# Altium schematic sheet 03.SchDoc
size 386 x 246 mm
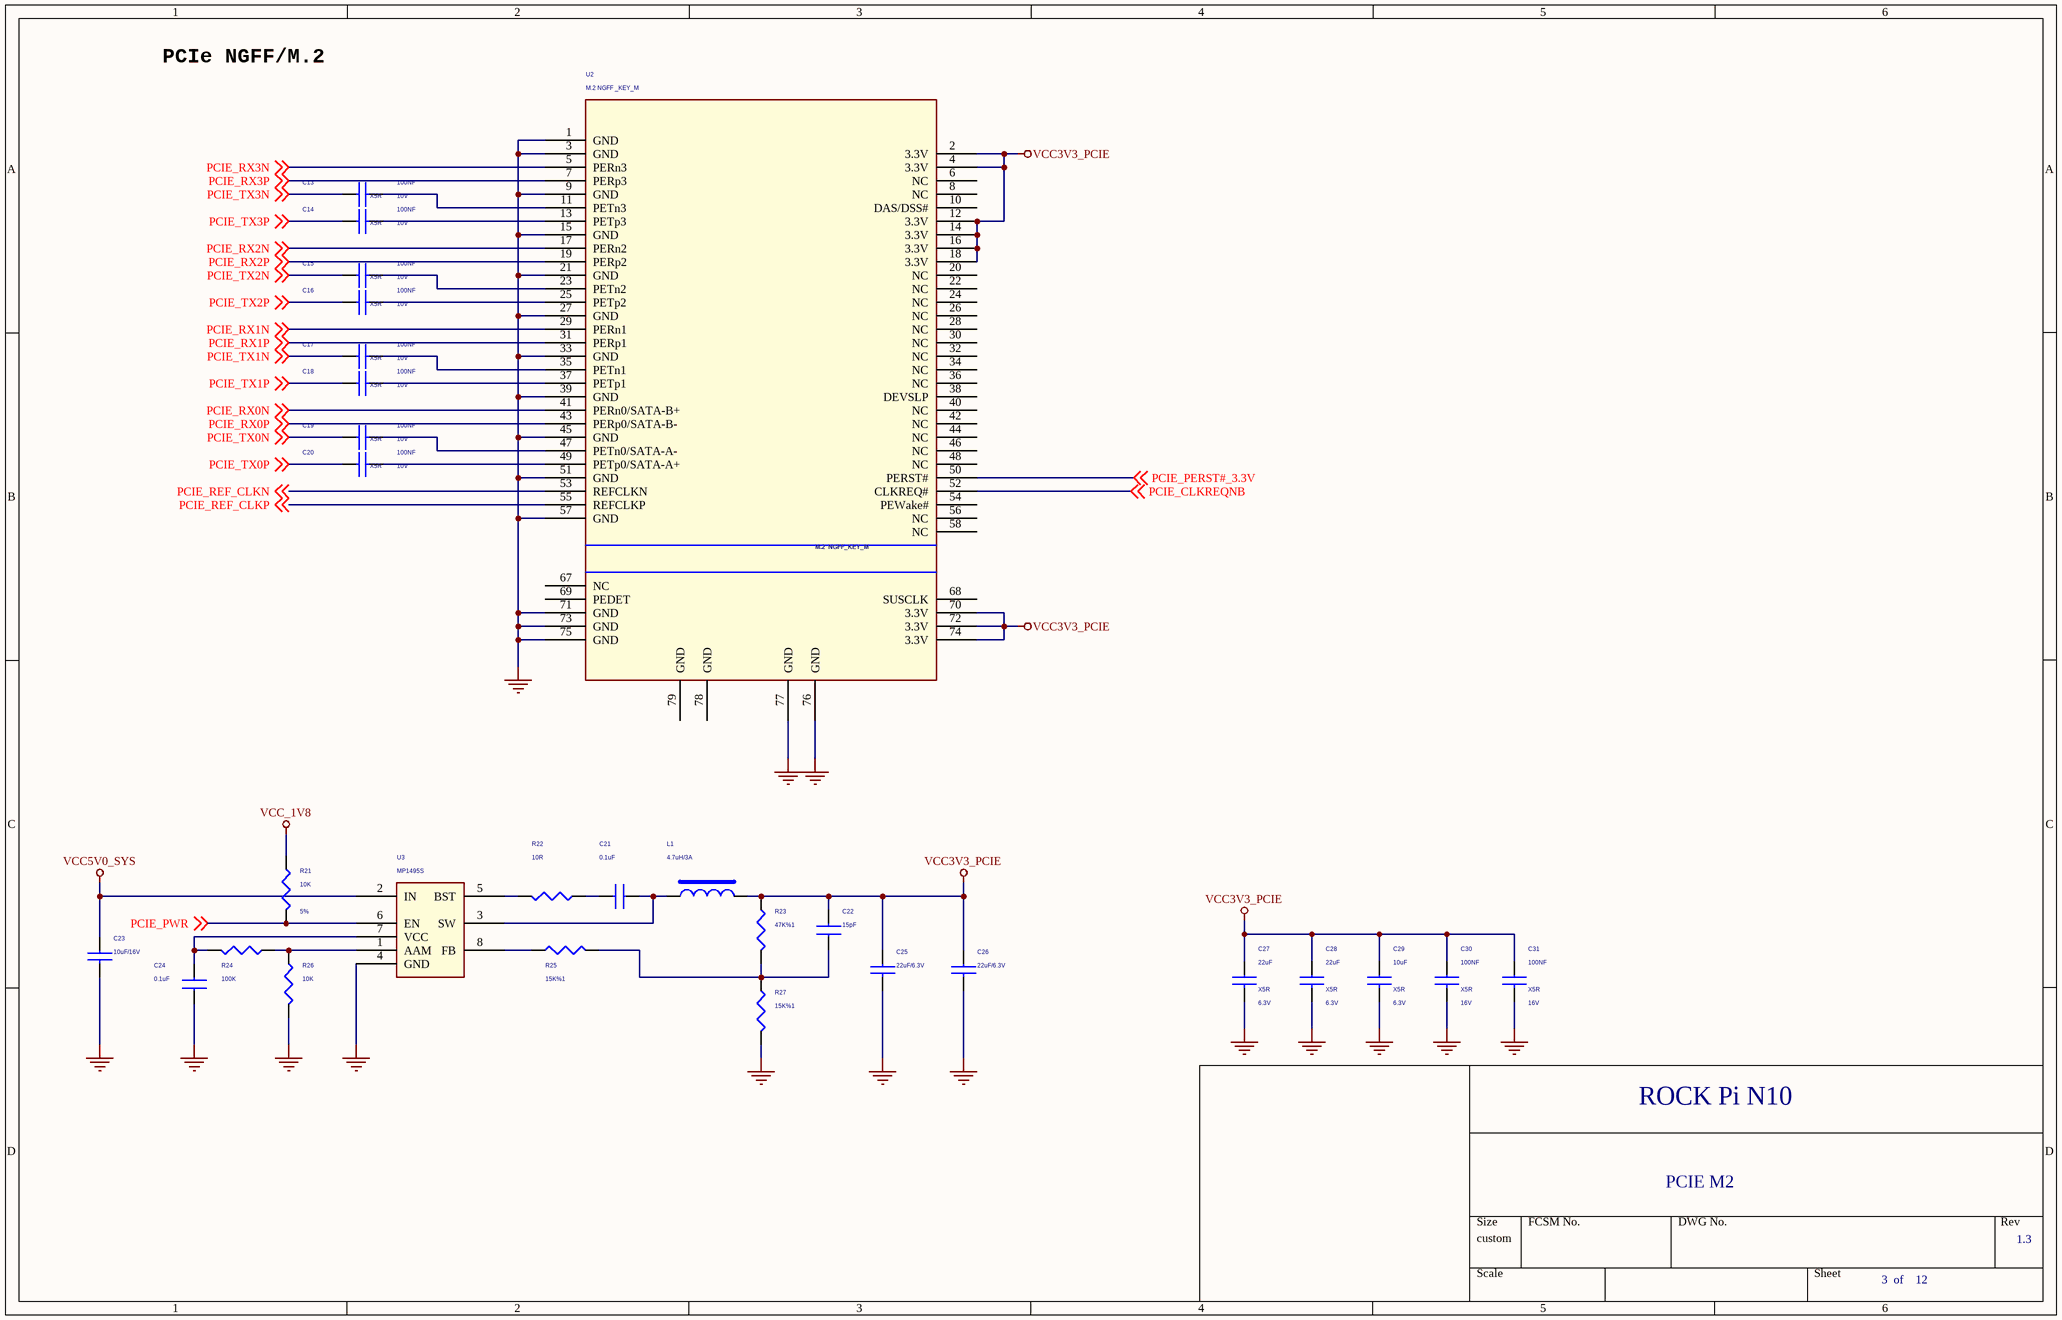
[diagram p0: 03.SchDoc]

## Parts
C13  100NF  Dielectric: X5R  Voltage: 10V  [C0201]
C14  100NF  Dielectric: X5R  Voltage: 10V  [C0201]
C15  100NF  Dielectric: X5R  Voltage: 10V  [C0201]
C16  100NF  Dielectric: X5R  Voltage: 10V  [C0201]
C17  100NF  Dielectric: X5R  Voltage: 10V  [C0201]
C18  100NF  Dielectric: X5R  Voltage: 10V  [C0201]
C19  100NF  Dielectric: X5R  Voltage: 10V  [C0201]
C20  100NF  Dielectric: X5R  Voltage: 10V  [C0201]
C21  0.1uF  [C0603]
C22  15pF  [C0603]
C23  10uF/16V  [C0805]
C24  0.1uF  [C0603]
C25  22uF/6.3V  [C0805]
C26  22uF/6.3V  [C0805]
C27  22uF  Dielectric: X5R  Voltage: 6.3V  [C0805]
C28  22uF  Dielectric: X5R  Voltage: 6.3V  [C0805]
C29  10uF  Dielectric: X5R  Voltage: 6.3V  [C0603]
C30  100NF  Dielectric: X5R  Voltage: 16V  [C0402]
C31  100NF  Dielectric: X5R  Voltage: 16V  [C0402]
L1  4.7uH/3A  [IND-6X6]
R21  10K  Tolerance: 5%  [R0402]
R22  10R  [R0402]
R23  47K%1  [R0402]
R24  100K  [R0402]
R25  15K%1  [R0402]
R26  10K  [R0402]
R27  15K%1  [R0402]
U2  M.2 NGFF _KEY_M  [M2_NGFF_KEY_M]
U3  MP1495S  [TSOT_23_8]

## Nets
GND: C23.2 C24.1 C25.2 C26.2 C27.2 C28.2 C29.2 C30.2 C31.2 R26.2 R27.2 U2.1(GND) U2.3(GND) U2.9(GND) U2.15(GND) U2.21(GND) U2.27(GND) U2.33(GND) U2.39(GND) U2.45(GND) U2.51(GND) U2.57(GND) U2.71(GND) U2.73(GND) U2.75(GND) U2.76(GND) U2.77(GND) U3.4(GND)
VCC3V3_PCIE: C22.2 C25.1 C26.1 C27.1 C28.1 C29.1 C30.1 C31.1 L1.2 R23.1 U2.2(3.3V) U2.4(3.3V) U2.12(3.3V) U2.14(3.3V) U2.16(3.3V) U2.18(3.3V) U2.70(3.3V) U2.72(3.3V) U2.74(3.3V)
VCC5V0_SYS: C23.1 U3.2(IN)
VCC_1V8: R21.1
PCIE_CLKREQNB: U2.52(CLKREQ#) ; off-sheet PCIE_CLKREQNB
PCIE_PERST#_3.3V: U2.50(PERST#) ; off-sheet PCIE_PERST#_3.3V
PCIE_PWR: R21.2 U3.6(EN) ; off-sheet PCIE_PWR
PCIE_REF_CLKN: U2.53(REFCLKN) ; off-sheet PCIE_REF_CLKN
PCIE_REF_CLKP: U2.55(REFCLKP) ; off-sheet PCIE_REF_CLKP
PCIE_RX0N: U2.41(PERn0/SATA-B+) ; off-sheet PCIE_RX0N
PCIE_RX0P: U2.43(PERp0/SATA-B-) ; off-sheet PCIE_RX0P
PCIE_RX1N: U2.29(PERn1) ; off-sheet PCIE_RX1N
PCIE_RX1P: U2.31(PERp1) ; off-sheet PCIE_RX1P
PCIE_RX2N: U2.17(PERn2) ; off-sheet PCIE_RX2N
PCIE_RX2P: U2.19(PERp2) ; off-sheet PCIE_RX2P
PCIE_RX3N: U2.5(PERn3) ; off-sheet PCIE_RX3N
PCIE_RX3P: U2.7(PERp3) ; off-sheet PCIE_RX3P
PCIE_TX0N: C19.1 ; off-sheet PCIE_TX0N
PCIE_TX0P: C20.1 ; off-sheet PCIE_TX0P
PCIE_TX1N: C17.1 ; off-sheet PCIE_TX1N
PCIE_TX1P: C18.1 ; off-sheet PCIE_TX1P
PCIE_TX2N: C15.1 ; off-sheet PCIE_TX2N
PCIE_TX2P: C16.1 ; off-sheet PCIE_TX2P
PCIE_TX3N: C13.1 ; off-sheet PCIE_TX3N
PCIE_TX3P: C14.1 ; off-sheet PCIE_TX3P
NetC13_2: C13.2 U2.11(PETn3)
NetC14_2: C14.2 U2.13(PETp3)
NetC15_2: C15.2 U2.23(PETn2)
NetC16_2: C16.2 U2.25(PETp2)
NetC17_2: C17.2 U2.35(PETn1)
NetC18_2: C18.2 U2.37(PETp1)
NetC19_2: C19.2 U2.47(PETn0/SATA-A-)
NetC20_2: C20.2 U2.49(PETp0/SATA-A+)
NetC21_1: C21.1 L1.1 U3.3(SW)
NetC21_2: C21.2 R22.1
NetC22_1: C22.1 R23.2 R25.2 R27.1
NetC24_2: C24.2 R24.2 U3.7(VCC)
NetR22_2: R22.2 U3.5(BST)
NetR24_1: R24.1 R26.1 U3.1(AAM)
NetR25_1: R25.1 U3.8(FB)

Not connected (* = marked no-connect by the designer): U2 6(NC) 8(NC) 10(DAS/DSS#) 20(NC) 22(NC) 24(NC) 26(NC) 28(NC) 30(NC) 32(NC) 34(NC) 36(NC) 38(DEVSLP) 40(NC) 42(NC) 44(NC) 46(NC) 48(NC) 54(PEWake#) 56(NC) 58(NC) 67(NC) 68(SUSCLK) 69(PEDET) 78(GND) 79(GND)

## Notes on the sheet
- PCIe NGFF/M.2
- ROCK Pi N10
- PCIE M2
- 1.3
- 3  of    12
- (in symbol M_5.2 NGFF EKEY SOCKET) M.2  NGFF_KEY_M

## Library data of the parts
C13-C18 = CAP NP_2: cap,100.00nF,+/-10%,10V,X5R,C0201; Manufacturer PN: C0603X5R1A104K030BC; Manufacturer: TDK; Tolerance: 10%; Priority: A; Created by: JJJ; Part Type: C0201; RK PN: C0603X5R1A104K030BC
C19 C20 = CAP NP_2: cap,100.00nF,+/-10%,10V,X5R,C0201; Manufacturer: TDK; RK PN: C0603X5R1A104K030BC; Priority: A; Tolerance: 10%; Part Type: C0201; Manufacturer PN: C0603X5R1A104K030BC; Created by: JJJ
C21 C22 C24 = CAP NP_Dup3: RoHS CHIP CAP 1uF +10/-10% 16V X5R
C23 C25 C26 = CAP NP_2_Dup1: ROOM: CHG
C27 C28 = CAP NP_2: cap,22.00uF,+/-20%,6.3V,X5R,C0603; Manufacturer PN: C1608X5R0J226M080AC; Manufacturer: TDK; Tolerance: 20%; Priority: A; Created by: JJJ; Part Type: C0603; RK PN: C1608X5R0J226M080AC
C29 = CAP NP_2: cap,10.00uF,+/-10%,6.3V,X5R,C0603; Manufacturer PN: C1608X5R0J106K080AB; Manufacturer: TDK; Tolerance: 10%; Priority: A; Created by: JJJ; Part Type: C0603; RK PN: C1608X5R0J106K080AB
C30 = CAP NP_2: cap,100.00nF,+/-10%,16V,X5R,C0402; Manufacturer: TDK; RK PN: C1005X5R1C104K050BA; Priority: A; Tolerance: 10%; Part Type: C0402; Manufacturer PN: C1005X5R1C104K050BA; Created by: JJJ
C31 = CAP NP_2: cap,100.00nF,+/-10%,16V,X5R,C0402; Manufacturer PN: C1005X5R1C104K050BA; Manufacturer: TDK; Tolerance: 10%; Priority: A; Created by: JJJ; Part Type: C0402; RK PN: C1005X5R1C104K050BA
L1 = INDUCTORS OF FERRITE_Dup1
R21 = RESISTOR_3: 通用厚膜电阻,10K,+/-5%,R0402,1/16W.; Manufacturer PN: RC0402JR-0710KL; Manufacturer: YAGEO; Wattage: 1/16W; Priority: A; Created by: YTL; Part Type: 通用厚膜电阻; RK PN: RC0402JR-0710KL
R22-R27 = RESISTOR_0: RES,thick film,47KOhm,+/-5%,1/16W,SMD0402; MARK: 51K
U2 = M_5.2 NGFF EKEY SOCKET
U3 = BUCK-MP1495